# EAGLE design cape (EAGLE 6.4)
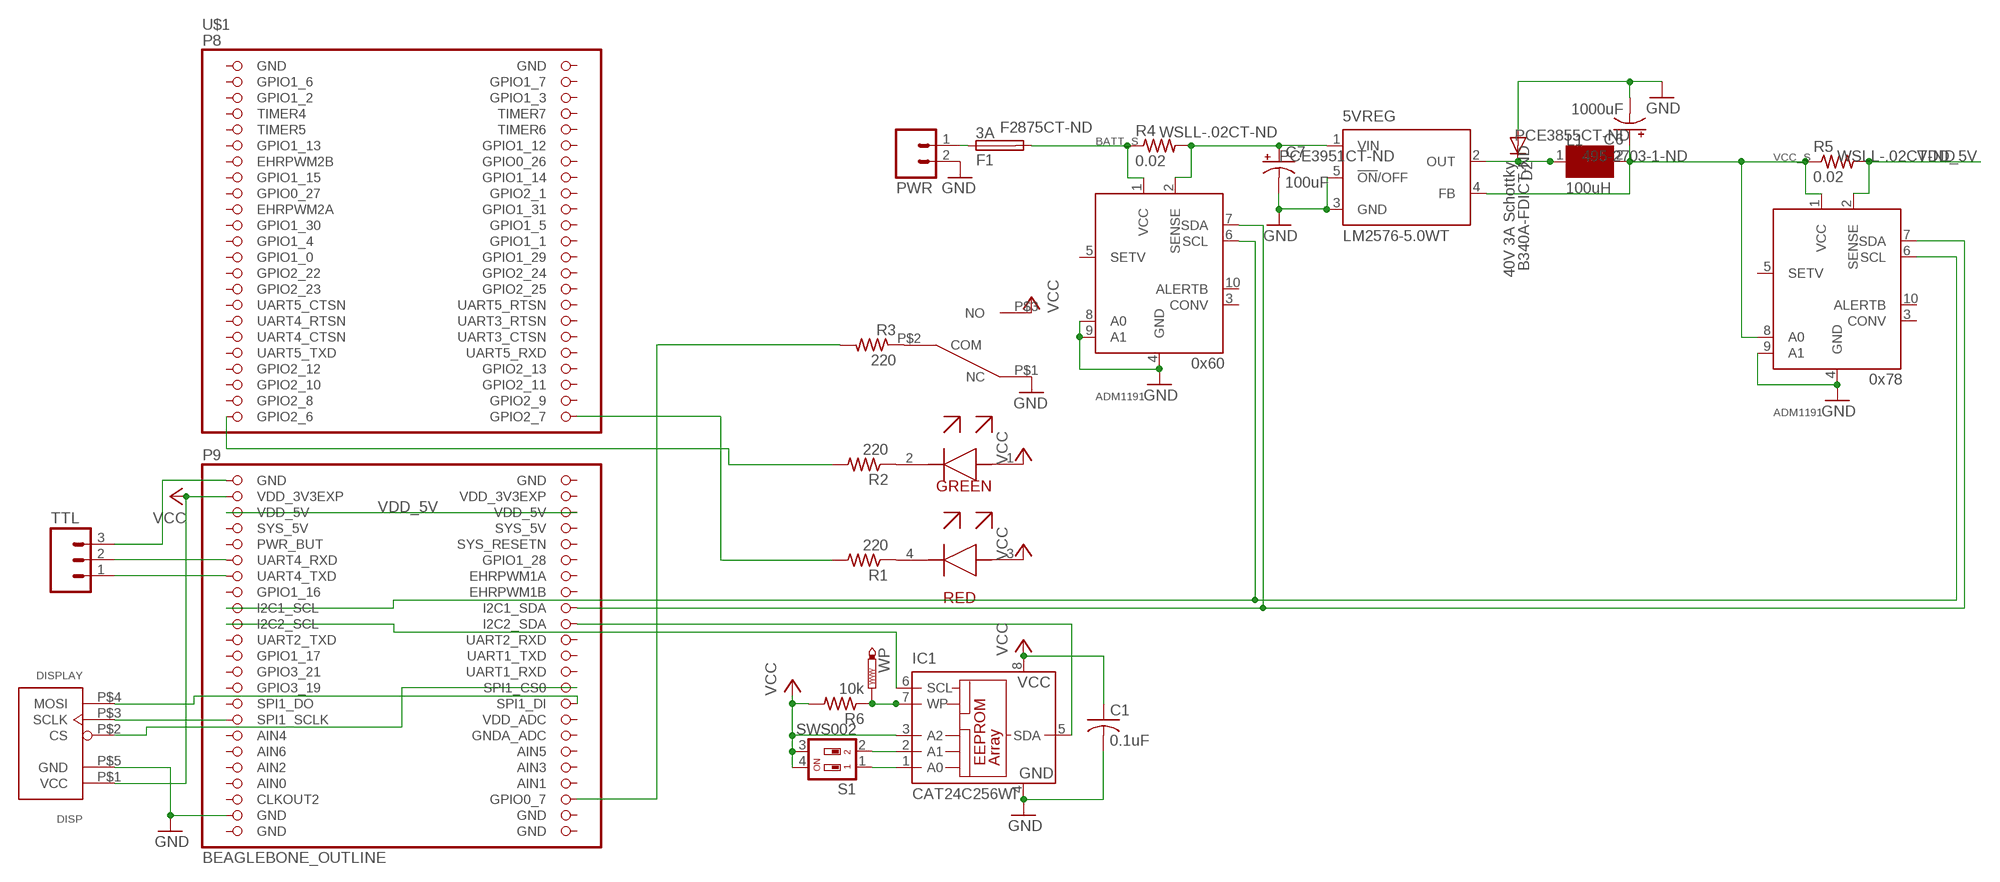
[diagram p0: schematic, sheet 1]

## Parts
5VREG  LM2576-5.0WT  LM2596S  [TO263-5]
BATT_S  ADM1191  [MSOP-10]
C1  0.1uF  C-USC0603  [C0603]
C6  1000uF  CPOL-US175TMP-0808  [175TMP-0808]
C7  100uF  CPOL-US153CLV-0605  [153CLV-0605]
D2  40V 3A Schottky  DIODE-DO-214AC  [DO-214AC]
DISP  DISPLAY  [1X6]
F1  3A  FUSE2920  [2920]
IC1  CAT24C256WI  24AA01SN  [SO-08]
L1  100uH  INDUCTOR  [INDUCTOR]
PWR  M025MM  [SCREWTERMINAL-5MM-2]
R1  220  R-US_R0603  [R0603]
R2  220  R-US_R0603  [R0603]
R3  220  R-US_R0603  [R0603]
R4  0.02  R-US_R0603  [R0603]
R5  0.02  R-US_R0603  [R0603]
R6  10k  R-US_R0603  [R0603]
S1  SWS002  [SMS-002]
TTL  M03LOCK  [1X03_LOCK]
U$1  BEAGLEBONE_OUTLINE  [BEAGLEBONE_SHIELD]
U$2  LEDS  [2X2]
U$3  SWITCH  [1X3]
VCC_S  ADM1191  [MSOP-10]
WP  PTR1TP10R  [TP10R]

## Nets
12V_FUSE: 5VREG.1(VIN) BATT_S.2(SENSE) C7.+ R4.2
12VDC: F1.1 PWR.1
CS: DISP.P$2(CS) U$1.74(SPI1_CS0)
GND: 5VREG.3(GND) 5VREG.5(!ON!/OFF) BATT_S.4(GND) BATT_S.8(A0) BATT_S.9(A1) C1.2 C6.- C7.- D2.A DISP.P$5(GND) IC1.4(GND) PWR.2 TTL.3 U$1.47(GND) U$1.89(GND) U$3.P$1(NC) VCC_S.4(GND) VCC_S.9(A1)
GRN_LED: R2.2 U$1.45(GPIO2_6)
I2C1_SCL: BATT_S.6(SCL) U$1.63(I2C1_SCL) VCC_S.6(SCL)
I2C1_SDA: BATT_S.7(SDA) U$1.64(I2C1_SDA) VCC_S.7(SDA)
I2C2_SCL: IC1.6(SCL) U$1.65(I2C2_SCL)
I2C2_SDA: IC1.5(SDA) U$1.66(I2C2_SDA)
N$1: R1.1 U$2.4
N$2: R2.1 U$2.2
N$3: R3.1 U$3.P$2(COM)
N$4: DISP.P$4(MOSI) U$1.76(SPI1_DI)
N$8: 5VREG.2(OUT) D2.C L1.1
N$9: BATT_S.1(VCC) F1.2 R4.1
N$11: IC1.1(A0) S1.1
N$12: IC1.2(A1) S1.2
N$13: 5VREG.4(FB) C6.+ L1.2 R5.1 VCC_S.1(VCC) VCC_S.8(A0)
N$17: IC1.7(WP) R6.1 WP.TP
RED_LED: R1.2 U$1.46(GPIO2_7)
RXI: TTL.2 U$1.57(UART4_RXD)
SCLK: DISP.P$3(SCLK) U$1.77(SPI1_SCLK)
SW: R3.2 U$1.88(GPIO0_7)
TXO: TTL.1 U$1.59(UART4_TXD)
VCC: C1.1 DISP.P$1(VCC) IC1.3(A2) IC1.8(VCC) R6.2 S1.3 S1.4 U$1.49(VDD_3V3EXP) U$2.1 U$2.3 U$3.P$3(NO)
VDD_5V: R5.2 U$1.51(VDD_5V) U$1.52(VDD_5V) VCC_S.2(SENSE)
Unconnected: BATT_S.3(CONV) BATT_S.5(SETV) BATT_S.10(ALERTB) U$1.3(GPIO1_6) U$1.4(GPIO1_7) U$1.5(GPIO1_2) U$1.6(GPIO1_3) U$1.7(TIMER4) U$1.8(TIMER7) U$1.9(TIMER5) U$1.10(TIMER6) U$1.11(GPIO1_13) U$1.12(GPIO1_12) U$1.13(EHRPWM2B) U$1.14(GPIO0_26) U$1.15(GPIO1_15) U$1.16(GPIO1_14) U$1.17(GPIO0_27) U$1.18(GPIO2_1) U$1.19(EHRPWM2A) U$1.20(GPIO1_31) U$1.21(GPIO1_30) U$1.22(GPIO1_5) U$1.23(GPIO1_4) U$1.24(GPIO1_1) U$1.25(GPIO1_0) U$1.26(GPIO1_29) U$1.27(GPIO2_22) U$1.28(GPIO2_24) U$1.29(GPIO2_23) U$1.30(GPIO2_25) U$1.31(UART5_CTSN) U$1.32(UART5_RTSN) U$1.33(UART4_RTSN) U$1.34(UART3_RTSN) U$1.35(UART4_CTSN) U$1.36(UART3_CTSN) U$1.37(UART5_TXD) U$1.38(UART5_RXD) U$1.39(GPIO2_12) U$1.40(GPIO2_13) U$1.41(GPIO2_10) U$1.42(GPIO2_11) U$1.43(GPIO2_8) U$1.44(GPIO2_9) U$1.54(SYS_5V) U$1.55(PWR_BUT) U$1.56(SYS_RESETN) U$1.58(GPIO1_28) U$1.60(EHRPWM1A) U$1.61(GPIO1_16) U$1.62(EHRPWM1B) U$1.67(UART2_TXD) U$1.68(UART2_RXD) U$1.69(GPIO1_17) U$1.70(UART1_TXD) U$1.71(GPIO3_21) U$1.72(UART1_RXD) U$1.73(GPIO3_19) U$1.75(SPI1_DO) U$1.78(VDD_ADC) U$1.79(AIN4) U$1.80(GNDA_ADC) U$1.81(AIN6) U$1.82(AIN5) U$1.83(AIN2) U$1.84(AIN3) U$1.86(AIN1) U$1.87(CLKOUT2) VCC_S.3(CONV) VCC_S.5(SETV) VCC_S.10(ALERTB)

## Notes on the sheet
- 0x60
- 0x78

## Power pins joined to a net without a drawn wire
AIN0: U$1.85(AIN0)
GND: U$1.1(GND) U$1.2(GND) U$1.48(GND) U$1.90(GND) U$1.91(GND) U$1.92(GND)
SYS_5V: U$1.53(SYS_5V)
VDD_3V3EXP: U$1.50(VDD_3V3EXP)

## Library data of the parts
5VREG = national-semiconductor:LM2596: SIMPLE SWITCHER® Power Converter 150 kHz 3A Step-Down Voltage Regulator Source: http://www.national.com/ds/LM/LM2596.pdf; MF: NATIONAL SEMICONDUCTOR; MPN: LM2596S-ADJ/NOPB; OC_FARNELL: 9494367; OC_NEWARK: 41K3842
BATT_S VCC_S = custom:ADM1191: ADM1191 I2C voltage-current monitor
C1 = rcl:C-US: CAPACITOR, American symbol
C6 = rcl:CPOL-US: POLARIZED CAPACITOR, American symbol; DIGIKEY: PCE3855CT-ND
C7 = rcl:CPOL-US: POLARIZED CAPACITOR, American symbol; DIGIKEY: PCE3951CT-ND
D2 = diode:DIODE-: DIODE; DIGIKEY: B340A-FDICT-ND
DISP = Twitterbot:DISPLAY: 4-digit 7-segment display
F1 = Twitterbot:FUSE2920: Littelfuse 2920; DIGIKEY: F2875CT-ND
IC1 = microchip:24*: Serial EEPROM I2C; MF: MICROCHIP; MPN: 24AA01/SN; OC_FARNELL: 1331268; OC_NEWARK: 89C9792
L1 = Twitterbot:INDUCTOR: Inductor; DIGIKEY: 495-2703-1-ND
PWR = SparkFun:M02: Header 2 Standard 2-pin 0.1" header. Use with straight break away headers (SKU : PRT-00116), right angle break away headers (PRT-00553), swiss pins (PRT-00743), machine pins (PRT-00117), and female headers (PRT-00115). Molex polarized connector foot print use with SKU : PRT-08233 with associated crimp pins and housings.
R1-R3 R6 = rcl:R-US_: RESISTOR, American symbol
R4 R5 = resistor:R-US_: RESISTOR, American symbol; DIGIKEY: WSLL-.02CT-ND
S1 = smd-special:SWS002: SMD Dip Switch 2 pol.
TTL = SparkFun:M03: Header 3 Standard 3-pin 0.1" header. Use with straight break away headers (SKU : PRT-00116), right angle break away headers (PRT-00553), swiss pins (PRT-00743), machine pins (PRT-00117), and female headers (PRT-00115). Molex polarized connector foot print use with SKU : PRT-08232 with associated crimp pins and housings.
U$1 = adafruit:BEAGLEBONE_OUTLINE: Should match A3 pinout - but not completely tested
U$2 = Twitterbot:LEDS: LED indicators
U$3 = Twitterbot:SWITCH: Microswitch
WP = testpad:PTR1: TEST PIN

## Board
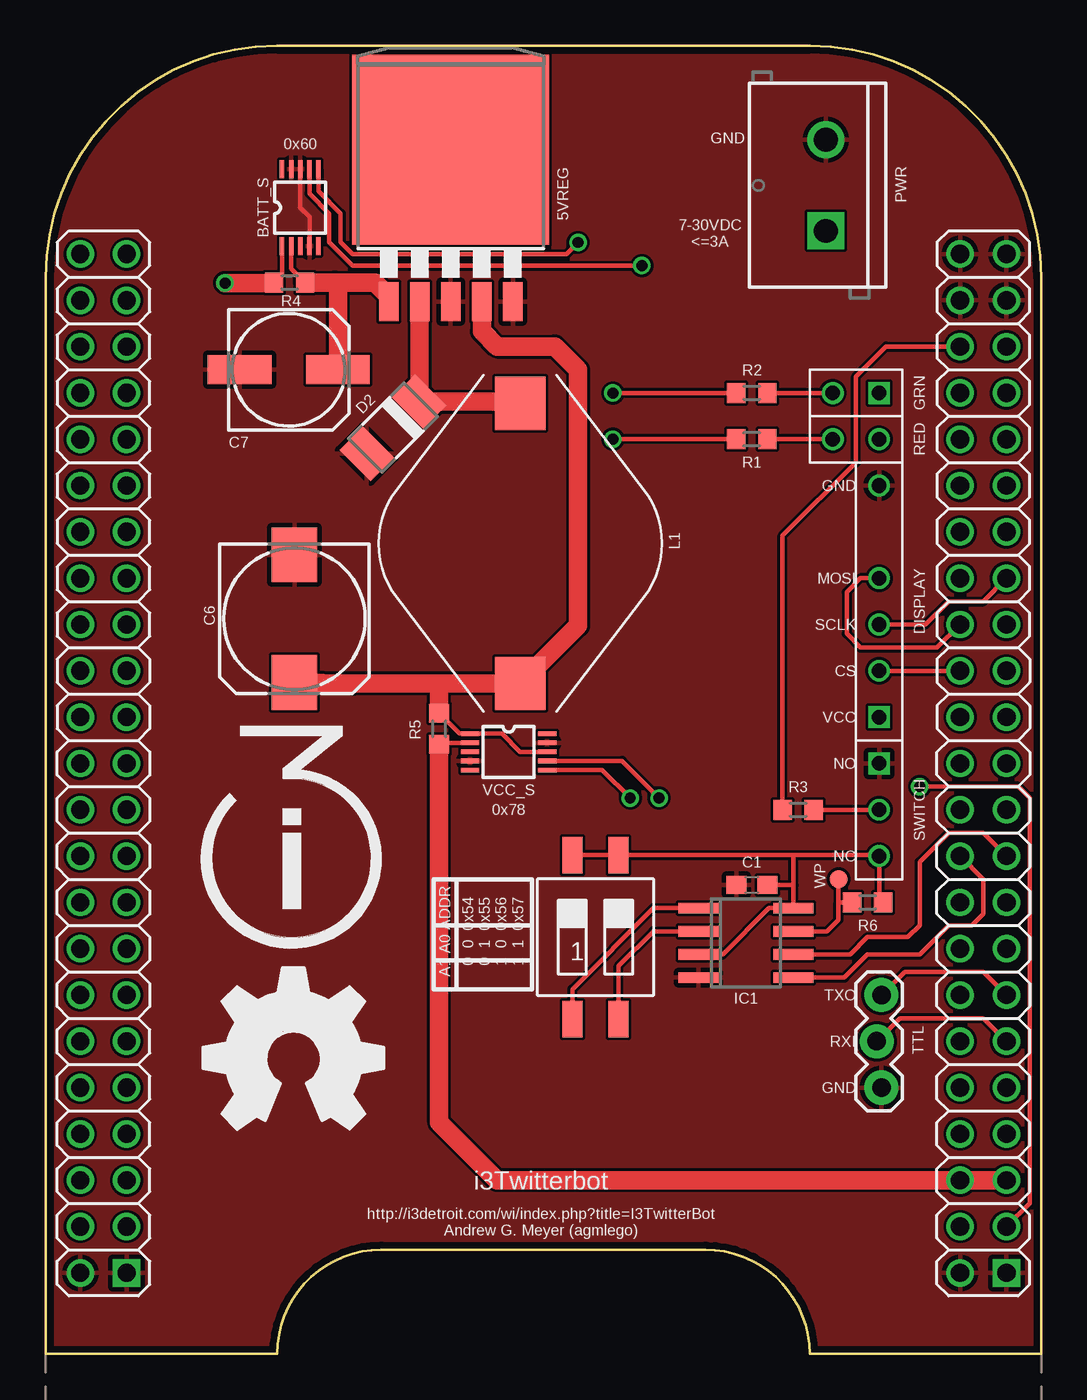
[diagram p1: board, top side]
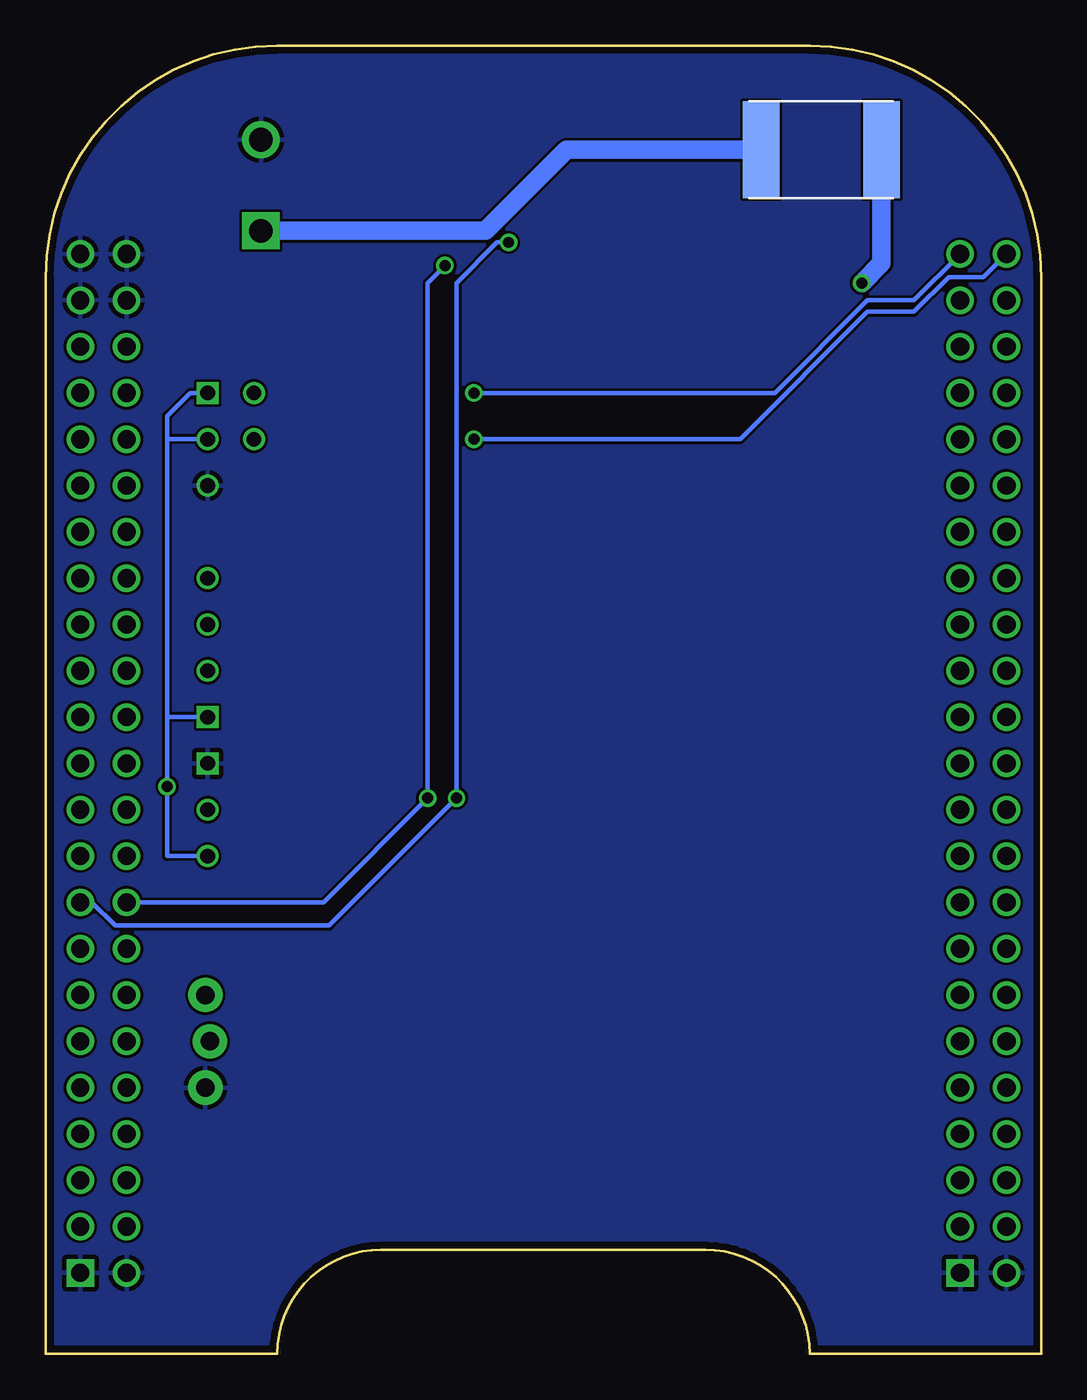
[diagram p2: board, bottom side, seen from below]

Size 54.61 x 71.75 mm. Coordinates in mm from the lower left corner, seen from the top.
Copper layers (1*16): Top 0.0356mm / dielectric 1.5011mm / Bottom 0.0356mm
Design rules "LaenPCBOrder": minimum track width 6mil, minimum drill 13mil, track to track 6mil, track to pad 6mil, pad to pad 6mil, via to via 6mil, smd to smd 6mil, copper to edge 15mil, drill to drill 6mil, minimum pad ring 7mil, minimum via ring 7mil, stop-mask expansion 4mil, vias tented up to drill 0mil, thermal gap 10mil

### Footprints (pad centres in the part's own frame; a part is rotated, then mirrored left to right if it is on the bottom)
TO263-5 = smd 1.067 x 2.159: 1 -3.404,-5.791; 2 -1.702,-5.791; 3 0,-5.791; 4 1.702,-5.791; 5 3.404,-5.791 | smd 10.8 x 10.41: 6 0,2.54
MSOP-10 = smd 0.25 x 1: 1 -1,-2.113; 2 -0.5,-2.113; 3 0,-2.113; 4 0.5,-2.113; 5 1,-2.113; 6 1,2.113; 7 0.5,2.113; 8 0,2.113; 9 -0.5,2.113; 10 -1,2.113
C0603 = smd 1.1 x 1: 1 -0.85,0; 2 0.85,0
175TMP-0808 = smd 3 x 2.5: + 3.5,0; - -3.5,0
153CLV-0605 = smd 3.5 x 1.6: + 2.7,0; - -2.7,0
DO-214AC = smd 1.8 x 2.4: A 2.025,0; C -2.025,0
1X6 = drill 0.8 square: P$1 0,6.35 | drill 0.8: P$2 0,3.81; P$3 0,1.27; P$4 0,-1.27; P$5 0,-6.35
2920 = smd 2.007 x 5.309: 1 -3.302,0; 2 3.302,0
SO-08 = smd 0.6 x 2.2: 1 -1.905,-2.6; 2 -0.635,-2.6; 3 0.635,-2.6; 4 1.905,-2.6; 5 1.905,2.6; 6 0.635,2.6; 7 -0.635,2.6; 8 -1.905,2.6
INDUCTOR = smd 2.92 x 2.79: 1 -7.685,0; 2 7.685,0
SCREWTERMINAL-5MM-2 = drill 1.3 pad 2.032 square: 1 0,0 | drill 1.3 pad 2.032: 2 5,0
R0603 = smd 1 x 1.1: 1 -0.85,0; 2 0.85,0
SMS-002 = smd 1.092 x 2.007: 1 -1.27,-4.496; 2 1.27,-4.496; 3 1.27,4.496; 4 -1.27,4.496
1X03_LOCK = drill 1.016 pad 1.88: 1 0,0.127; 2 2.54,-0.127; 3 5.08,0.127
BEAGLEBONE_SHIELD = drill 1 square: 1 4.445,19.05; 47 52.705,19.05 | drill 1: 2 1.905,19.05; 3 4.445,21.59; 4 1.905,21.59; 5 4.445,24.13; 6 1.905,24.13; 7 4.445,26.67; 8 1.905,26.67; 9 4.445,29.21; 10 1.905,29.21; 11 4.445,31.75; 12 1.905,31.75; 13 4.445,34.29; 14 1.905,34.29; 15 4.445,36.83; 16 1.905,36.83; 17 4.445,39.37; 18 1.905,39.37; 19 4.445,41.91; 20 1.905,41.91; 21 4.445,44.45; 22 1.905,44.45; 23 4.445,46.99; 24 1.905,46.99; 25 4.445,49.53; 26 1.905,49.53; 27 4.445,52.07; 28 1.905,52.07; 29 4.445,54.61; 30 1.905,54.61; 31 4.445,57.15; 32 1.905,57.15; 33 4.445,59.69; 34 1.905,59.69; 35 4.445,62.23; 36 1.905,62.23; 37 4.445,64.77; 38 1.905,64.77; 39 4.445,67.31; 40 1.905,67.31; 41 4.445,69.85; 42 1.905,69.85; 43 4.445,72.39; 44 1.905,72.39; 45 4.445,74.93; 46 1.905,74.93; 48 50.165,19.05; 49 52.705,21.59; 50 50.165,21.59; 51 52.705,24.13; 52 50.165,24.13; 53 52.705,26.67; 54 50.165,26.67; 55 52.705,29.21; 56 50.165,29.21; 57 52.705,31.75; 58 50.165,31.75; 59 52.705,34.29; 60 50.165,34.29; 61 52.705,36.83; 62 50.165,36.83; 63 52.705,39.37; 64 50.165,39.37; 65 52.705,41.91; 66 50.165,41.91; 67 52.705,44.45; 68 50.165,44.45; 69 52.705,46.99; 70 50.165,46.99; 71 52.705,49.53; 72 50.165,49.53; 73 52.705,52.07; 74 50.165,52.07; 75 52.705,54.61; 76 50.165,54.61; 77 52.705,57.15; 78 50.165,57.15; 79 52.705,59.69; 80 50.165,59.69; 81 52.705,62.23; 82 50.165,62.23; 83 52.705,64.77; 84 50.165,64.77; 85 52.705,67.31; 86 50.165,67.31; 87 52.705,69.85; 88 50.165,69.85; 89 52.705,72.39; 90 50.165,72.39; 91 52.705,74.93; 92 50.165,74.93
2X2 = drill 0.8 square: 1 -1.27,1.27 | drill 0.8: 2 -1.27,-1.27; 3 1.27,1.27; 4 1.27,-1.27
1X3 = drill 0.8 square: P$1 0,2.54 | drill 0.8: P$2 0,0; P$3 0,-2.54
TP10R = smd 1 x 1: TP 0,0

### Placement (x,y rotation side)
5VREG  22.23,63.5 0 top
BATT_S  13.97,62.86 0 top
C1  38.73,25.72 180 top
C6  13.65,40.32 270 top
C7  13.34,53.97 0 top
D2  19.05,50.8 225 top
DISP  45.72,41.28 180 top
F1  12.06,66.04 0 bottom
IC1  38.42,22.54 270 top
L1  26.04,44.45 270 top
PWR  42.8,61.59 90 top
R1  38.73,50.16 180 top
R2  38.73,52.7 180 top
R3  41.27,29.85 180 top
R4  13.38,58.77 0 top
R5  21.59,34.29 270 top
R6  45.09,24.76 0 top
S1  30.16,22.86 0 top
TTL  45.72,19.68 270 top
U$1  0,-14.61 0 top
U$2  44.45,51.44 270 top
U$3  45.72,29.85 0 top
U$4  [OSHW_FILLX350_NOTEXT]  8.64,12.32 0 top
VCC_S  25.4,33.02 270 top
WP  43.5,26.04 0 top

### Tracks (layer width: path | path; a pad name or v marks a point on that pad's centre or on a via)
12V_FUSE
  Top 0.254: BATT_S.2 13.47,59.52 R4.2
  Top 1.016: R4.2 15.88,58.77 | 15.88,58.77 18.07,58.77 18.82,58.01 5VREG.1 | C7.+ 16.04,58.6 15.88,58.77
12VDC
  Bottom 1.016: PWR.1 30.48,61.59 26.04,66.04 F1.1
CS
  Top 0.254: DISP.P$2 U$1.74
GND
  Top 0.254: BATT_S.8 13.97,62.86 14.47,62.36 BATT_S.4
  pour Bottom: 0,-0.13 0,59.05 arc-90 12.7,71.75 41.91,71.75 arc-90 54.61,59.05 54.61,-0.13 41.91,-0.13 arc90 36.07,5.71 18.54,5.71 arc90 12.7,-0.13
  pour Top: 0,-0.13 0,59.05 arc-90 12.7,71.75 41.91,71.75 arc-90 54.61,59.05 54.61,-0.13 41.91,-0.13 arc90 36.07,5.71 18.54,5.71 arc90 12.7,-0.13
GRN_LED  (via drill 0.6)
  Top 0.254: R2.2 v31.11,52.7
  Bottom 0.254: v31.11,52.7 14.61,52.7 9.53,57.78 6.99,57.78 U$1.45
I2C1_SCL  (via drill 0.6)
  Top 0.254: VCC_S.6 30.53,32.02 v32.07,30.48 | BATT_S.6 14.97,63.77 16.19,62.55 16.19,60.96 16.83,60.33 28.57,60.33 v29.21,60.96
  Bottom 0.254: U$1.63 52.07,24.76 50.8,23.5 39.05,23.5 v32.07,30.48 32.07,58.74 29.84,60.96 v29.21,60.96
I2C1_SDA  (via drill 0.6)
  Top 0.254: VCC_S.7 31.61,32.52 v33.66,30.48 | BATT_S.7 14.47,63.63 15.56,62.55 15.56,60.96 16.83,59.69 v32.7,59.69
  Bottom 0.254: U$1.64 39.37,24.76 v33.66,30.48 33.66,58.74 v32.7,59.69
I2C2_SCL
  Top 0.254: IC1.6 44.13,21.91 45.09,22.86 47.31,22.86 47.94,23.5 47.94,26.99 49.53,28.57 51.44,28.57 U$1.65
I2C2_SDA
  Top 0.254: IC1.5 43.81,20.64 45.09,21.91 47.94,21.91 49.53,23.5 50.8,23.5 51.44,24.13 51.44,26.04 U$1.66
N$1
  Top 0.254: U$2.4 R1.1
N$2
  Top 0.254: U$2.2 R2.1
N$3
  Top 0.254: U$3.P$2 R3.1
N$4
  Top 0.254: DISP.P$4 44.7,42.55 43.94,41.78 43.94,39.5 44.7,38.73 48.9,38.73 U$1.76
N$8
  Top 1.016: 5VREG.2 20.52,52.27 D2.C 25.94,52.23 L1.1
N$9  (via drill 0.6)
  Top 0.254: BATT_S.1 12.97,59.2 R4.1
  Top 1.016: R4.1 12.5,58.74 v9.84,58.74
  Bottom 1.016: F1.2 8.76,59.82 v9.84,58.74
N$11
  Top 0.254: S1.1 28.89,20 33.34,24.45 IC1.1
N$12
  Top 0.254: S1.2 31.43,21.27 33.34,23.18 IC1.2
N$13
  Top 0.254: R5.1 22.71,34.02 VCC_S.1 25.04,34.02 26.04,33.02 VCC_S.8
  Top 1.016: 5VREG.4 23.93,56.08 24.77,55.24 27.94,55.24 29.21,53.97 29.21,39.94 L1.2 21.59,36.77 | 21.59,36.77 16.89,36.77 C6.+ | R5.1 21.59,36.77
N$17
  Top 0.254: 43.5,24.76 R6.1 | WP.TP 43.5,24.76 | IC1.7 42.86,23.18 43.5,23.81 43.5,24.76
RED_LED  (via drill 0.6)
  Top 0.254: R1.2 v31.11,50.16
  Bottom 0.254: v31.11,50.16 16.51,50.16 9.53,57.15 6.99,57.15 5.08,59.05 3.17,59.05 U$1.46
RXI
  Top 0.254: U$1.57 51.44,18.42 46.86,18.42 TTL.2
SCLK
  Top 0.254: DISP.P$3 48.26,40 49.53,41.28 51.44,41.28 U$1.77
SW
  Top 0.254: R3.2 40.42,44.87 44.45,48.89 44.45,53.59 46.1,55.24 U$1.88
TXO
  Top 0.254: U$1.59 51.44,20.96 47.12,20.96 TTL.1
VCC  (via drill 0.6)
  Top 0.254: R6.2 45.72,24.98 U$3.P$3 45.67,27.36 40.96,27.36 | 40.96,27.36 S1.3 S1.4 | IC1.3 37.15,21.91 39.69,24.45 IC1.8 41.02,25.72 | 41.02,25.72 41.02,27.3 40.96,27.36 | C1.1 41.02,25.72 | U$1.49 53.98,8.25 53.98,30.48 53.34,31.11 v47.94,31.11
  Bottom 0.254: 47.94,34.92 v47.94,31.11 47.94,27.3 U$3.P$3 | 47.94,34.92 47.94,50.16 | 47.94,50.16 47.94,51.44 46.67,52.7 U$2.1 | U$2.3 47.94,50.16 | DISP.P$1 47.94,34.92
VDD_5V
  Top 0.254: VCC_S.2 21.67,33.52 R5.2
  Top 1.016: U$1.51 U$1.52 24.77,9.52 21.59,12.7 R5.2

### Text on the board
tDocu: A0 | A1
_tsilk: GND | 0x60 | 7-30VDC / <=3A | GRN | RED | GND | MOSI | SCLK | CS | VCC | NO | 0x78 | NC | A1 A0 ADDR | 0 0 0x54 / 0 1 0x55 / 1 0 0x56 / 1 1 0x57 | TXO | RXI | GND | i3Twitterbot | http://i3detroit.com/wi/index.php?title=I3TwitterBot / Andrew G. Meyer (agmlego)